# Altium schematic sheet JTAG ICE.SchDoc: JTAGICE
size A3; CheckedBy: Mohammad Sadr; Author: Mohammad Sadr; CompanyName: www.mElectronics.ir; DrawnBy: Mohammad Sadr; Engineer: Mohammad Sadr; Organization: Mohammad Sadr; Address1: Iran, Tehran; Address2: Shamsipour College (STVC); Address3: Electronic engineering; Address4: www.mElectronics.ir; DocumentNumber: 8.0; Revision: v 8.2; SheetNumber: 1; SheetTotal: 2; DocumentName: JTAGICE; ImagePath: Mohammad Sadr; ProjectName: JTAGICE
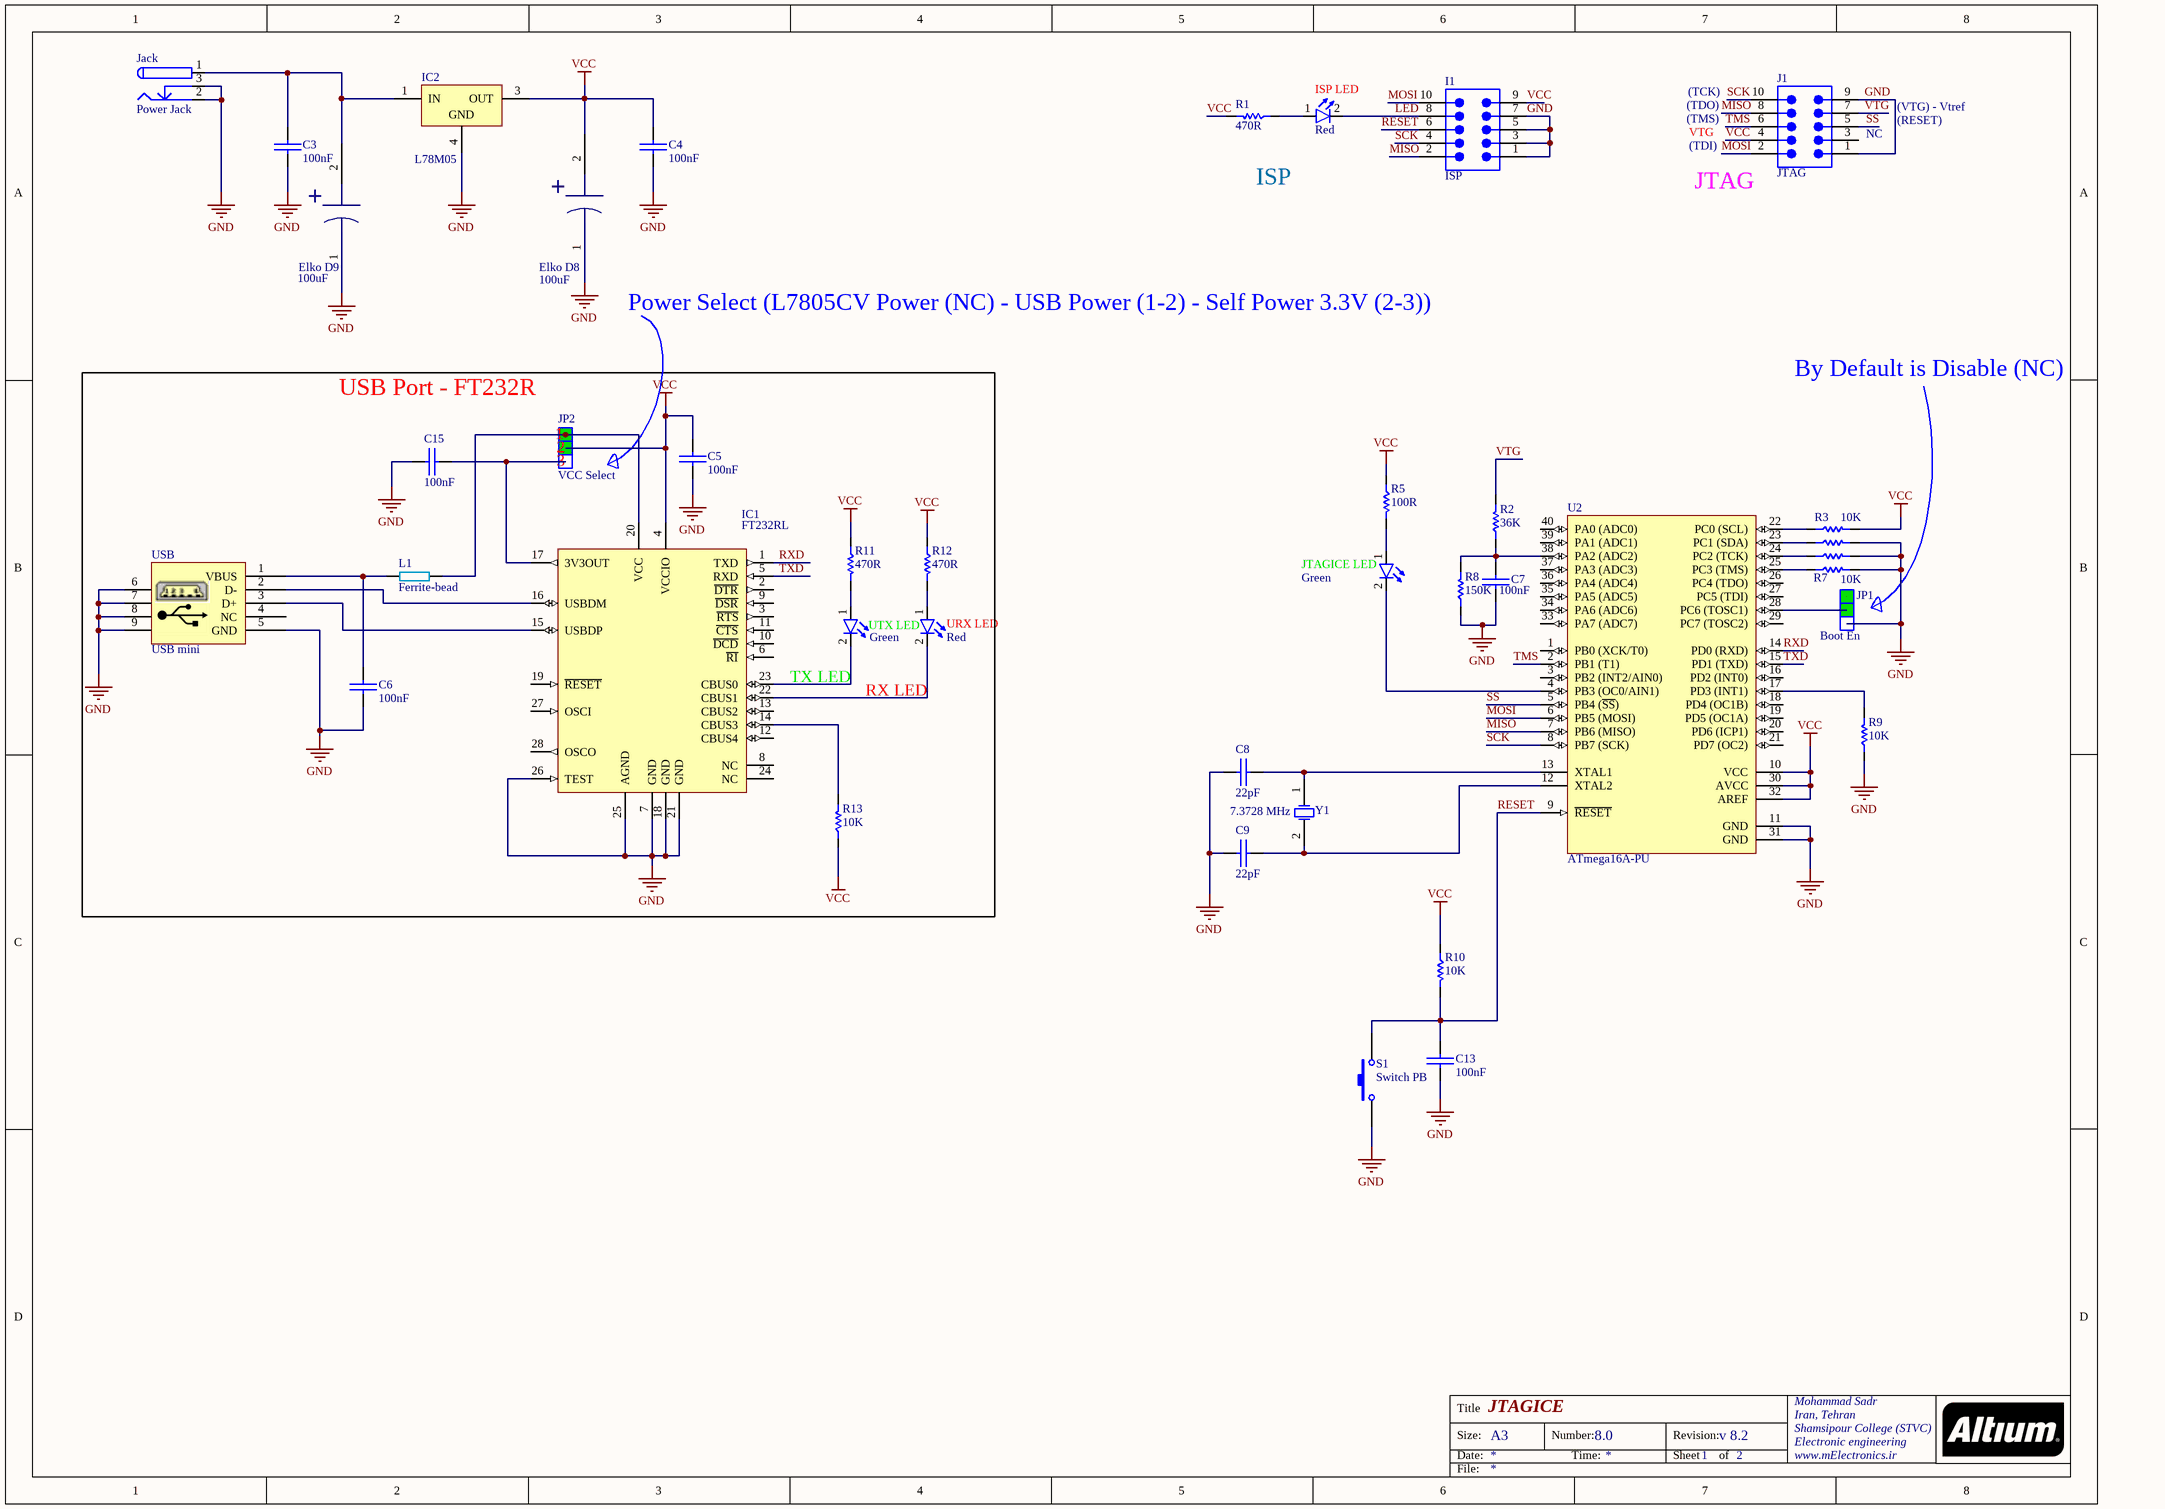
[diagram p0: JTAG ICE.SchDoc]

## Parts
C3  100nF  [SMD_CAP_1206]
C4  100nF  [SMD_CAP_1206]
C5  100nF  [SMD_CAP_1206]
C6  100nF  [SMD_CAP_1206]
C7  100nF  [SMD_CAP_1206]
C8  22pF  [SMD_CAP_1206]
C9  22pF  [SMD_CAP_1206]
C13  100nF  [SMD_CAP_1206]
C15  100nF  [SMD_CAP_1206]
Elko_D8  100uF  [Elko D8 package]
Elko_D9  100uF  [Elko D8 package]
I1  ISP  [9181109621]
IC1  FT232RL  [SSOP-28_M]
IC2  L78M05  [TO-263]
ISP_LED  Red  [LED SMD 1206]
J1  JTAG  [9181109621]
Jack  Power Jack  [Power Jack]
JP1  Boot En  [jumper selector]
JP2  VCC Select  [jumper selector]
JTAGICE_LED  Green  [LED SMD 1206]
L1  Ferrite-bead  [Ferrite-bead]
R1  470R  [SMD_RES_1206]
R2  36K  [SMD_RES_1206]
R3  10K  [SMD_RES_1206]
R4  10K  [SMD_RES_1206]  (value not drawn)
R5  100R  [SMD_RES_1206]
R6  10K  [SMD_RES_1206]  (value not drawn)
R7  10K  [SMD_RES_1206]
R8  150K  [SMD_RES_1206]
R9  10K  [SMD_RES_1206]
R10  10K  [SMD_RES_1206]
R11  470R  [SMD_RES_1206]
R12  470R  [SMD_RES_1206]
R13  10K  [SMD_RES_1206]
S1  Switch PB  [Switch - Push to On]
U2  ATmega16A-PU  [44A_M]
URX_LED  Red  [LED SMD 1206]
USB  USB mini  [SMD_Mini USB Connector]
UTX_LED  Green  [LED SMD 1206]
Y1  7.3728 MHz  [Crystal SMD]

## Blocks framed on the sheet
USB Port - FT232R: C5 C6 C15 IC1 JP2 L1 R11-R13 URX_LED USB UTX_LED

## Nets
GND: C3.2(-) C4.2(-) C5.2(-) C6.2(-) C7.2(-) C8.1(+) C9.1(+) C13.2(-) C15.1(+) Elko_D8.1 Elko_D9.1 I1.1 I1.3 I1.5 I1.7 IC1.7(GND) IC1.18(GND) IC1.21(GND) IC1.25(AGND) IC1.26(TEST) IC2.4(GND) J1.1 J1.9 Jack.2 Jack.3 JP1.3 R4.2 R6.2 R7.2 R8.1 R9.1 S1.1 U2.11(GND) U2.31(GND) USB.5(GND) USB.6 USB.7 USB.8 USB.9
VCC: C4.1(+) C5.1(+) Elko_D8.2 I1.9 IC1.4(VCCIO) IC2.3(OUT) J1.4 JP2.2 R1.2 R3.2 R5.1 R10.1 R11.1 R12.1 R13.1 U2.10(VCC) U2.30(AVCC) U2.32(AREF)
LED: I1.8 ISP_LED.2(K)
MISO: I1.2 J1.8 U2.7(PB6_(MISO))
MOSI: I1.10 J1.2 U2.6(PB5_(MOSI))
RESET: C13.1(+) I1.6 R10.2 S1.2 U2.9(~{RESET})
RXD: IC1.1(TXD) U2.14(PD0_(RXD))
SCK: I1.4 J1.10 U2.8(PB7_(SCK))
SS: J1.5 U2.5(PB4_(~{SS}))
TMS: J1.6 U2.2(PB1_(T1))
TXD: IC1.5(RXD) U2.15(PD1_(TXD))
VTG: J1.7 R2.2
NetC3_1: C3.1(+) Elko_D9.2 IC2.1(IN) Jack.1
NetC6_1: C6.1(+) L1.1 USB.1(VBUS)
NetC7_1: C7.1(+) R2.1 R8.2 U2.38(PA2_(ADC2))
NetC8_2: C8.2(-) U2.13(XTAL1) Y1.1(OSC1)
NetC9_2: C9.2(-) U2.12(XTAL2) Y1.2(OSC2)
NetC15_2: C15.2(-) IC1.17(3V3OUT) JP2.3
NetIC1_14: IC1.14(CBUS3) R13.2
NetIC1_15: IC1.15(USBDP) USB.3(D+)
NetIC1_16: IC1.16(USBDM) USB.2(D-)
NetIC1_20: IC1.20(VCC) JP2.1 L1.2
NetIC1_22: IC1.22(CBUS1) URX_LED.2(K)
NetIC1_23: IC1.23(CBUS0) UTX_LED.2(K)
NetISP_LED_1: ISP_LED.1(A) R1.1
NetJP1_2: JP1.2 U2.28(PC6_(TOSC1))
NetJTAGICE_LED_1: JTAGICE_LED.1(A) R5.2
NetJTAGICE_LED_2: JTAGICE_LED.2(K) U2.4(PB3_(OC0/AIN1))
NetR3_1: R3.1 U2.22(PC0_(SCL))
NetR4_1: R4.1 U2.23(PC1_(SDA))
NetR6_1: R6.1 U2.24(PC2_(TCK))
NetR7_1: R7.1 U2.25(PC3_(TMS))
NetR9_2: R9.2 U2.17(PD3_(INT1))
NetR11_2: R11.2 UTX_LED.1(A)
NetR12_2: R12.2 URX_LED.1(A)

Not connected (* = marked no-connect by the designer): IC1 2(~{DTR}) 3(~{RTS}) 6(~{RI}) 8(NC) 9(~{DSR}) 10(~{DCD}) 11(~{CTS}) 12(CBUS4) 13(CBUS2) 19(~{RESET}) 24(NC) 27(OSCI) 28(OSCO); J1 3; JP1 1; U2 1(PB0_(XCK/T0)) 3(PB2_(INT2/AIN0)) 16(PD2_(INT0)) 18(PD4_(OC1B)) 19(PD5_(OC1A)) 20(PD6_(ICP1)) 21(PD7_(OC2)) 26(PC4_(TDO)) 27(PC5_(TDI)) 29(PC7_(TOSC2)) 33(PA7_(ADC7)) 34(PA6_(ADC6)) 35(PA5_(ADC5)) 36(PA4_(ADC4)) 37(PA3_(ADC3)) 39(PA1_(ADC1)) 40(PA0_(ADC0)); USB 4(NC)

## Notes on the sheet
- (TDO)
- (TCK)
- (VTG) - Vtref
- (TMS)
- VTG
- (TDI)
- (near J1) NC
- (RESET)
- ISP
- (near J1) JTAG
- (near Elko_D8) Power Select (L7805CV Power (NC) - USB Power (1-2) - Self Power 3.3V (2-3))
- By Default is Disable (NC)
- (near JP2) 1
- (near JP2) 2
- (near JP2) 3
- TX LED
- RX LED
- Title
- Size:
- Date:
- A3
- Number:
- Time:
- Revision:
- Sheet
- of
- File:
- (in symbol Elko D8 package) +

## Library data of the parts
C3-C9 C13 C15 = Cap-Bipolar: Bipolar Capacitor; Voltage: 100V; Designer: Saeid Jorablo; Organazation: ControTec; Adding Date: 1387/12/20
  C3-C7 C13 C15: Value: 100nF
  C8 C9: Value: 22pF
Elko_D8 Elko_D9 = Elko D8 package: Elko D8 package: 100uF
I1 J1 = 09 18 110 9621: Flat Cable Connector (IDC), PCB Transition Connector, 2 Rows, Solder Pin, 10 Contacts; PCB_Layout: Complies with manufacturer's recommendation.; DrillSize: Corresponds to nominal value.; Published: 15-Nov-2004; DatasheetDocument: Sep-2003; PackageDocument: 26-Nov-2003; PackageReference: 9181109621; Publisher: Altium Limited; ComponentLink1Description: Manufacturer Link; ComponentLink1URL: http://www.harting.com/; ComponentLink2Description: Selection Guide; ComponentLink2URL: http://www.harting.com/imperia/md/content/steckverbinderundsystemkomponenten/folder/interface_engl_chapter_09.pdf
IC1 = FT232RL: USB UART Asynchronous Serial Data Transfer Chip, SSOP-28, Tape and Reel; Published: 19-Aug-2010; DatasheetVersion: ver 2.07, Jul-2010; PackageVersion: 2010; PackageReference: SSOP-28; Publisher: Altium Limited; PackageDescription: 28-Pin Small Outline Package 0.65 mm Pitch; ComponentLink1Description: Manufacturer Link; ComponentLink1URL: http://www.ftdichip.com/Products/ICs/FT232R.htm; ComponentLink2Description: Datasheet; ComponentLink2URL: http://www.ftdichip.com/Support/Documents/DataSheets/ICs/DS_FT232R.pdf
IC2 = L78M05: Precision 500mA Regulator
ISP_LED JTAGICE_LED URX_LED UTX_LED = LED: Designer: Saeid Jorablo; Organazation: ControTec; Adding Date: 1387/12/22; Size: SMD 1206
  ISP_LED URX_LED: Color: Red
  JTAGICE_LED UTX_LED: Color: Green
Jack = Power Jack: Designer: Saeid Jorablo; Company: Personal; Project Name: Laser; Adding Date: 10/21/2009
JP1 JP2 = Jumper Selector
R1-R13 = Resistor: Tolerance: 5%; Power: 1/4 W
  R1 R11 R12: Value: 470R
  R2: Value: 36K
  R3 R4 R6 R7 R9 R10 R13: Value: 10K
  R5: Value: 100R
  R8: Value: 150K
S1 = Switch PB: Push Button Switch
U2 = ATmega16A-PU: 8-bit AVR Microcontroller, 16KB Flash, 512 Bytes EEPROM, 1KB SRAM, 40-pin PDIP, Industrial Grade (-40°C to 85°C); Published: 1-Apr-2010; DatasheetVersion: revB, Jul-2009; PackageVersion: revB, Sep-2001; PackageReference: 40P6; Publisher: Altium Limited; PackageDescription: 40-lead (0.600"/15.24mm Wide) Plastic Dual Inline Package (PDIP); Supplier 1: Digi-Key; Supplier Part Number 1: ATMEGA16A-PU-ND; Supplier 2: Farnell; Supplier Part Number 2: 1704561; Supplier 3: Mouser; Supplier Part Number 3: 556-ATMEGA16A-PU; Code_JEDEC: MS-011-AC; ComponentLink1Description: Manufacturer Link; ComponentLink1URL: http://www.atmel.com/products/avr/default.asp?; ComponentLink2Description: ATmega16A Datasheet; ComponentLink2URL: http://www.atmel.com/dyn/resources/prod_documents/doc8154.pdf; ComponentLink3Description: ATmega16A Summary; ComponentLink3URL: http://www.atmel.com/dyn/resources/prod_documents/8154S.pdf; ComponentLink4Description: Atmel.com Home; ComponentLink4URL: http://www.atmel.com
USB = USB mini: mini USB Connector
Y1 = XTAL: XTAL Crystal; Company: E.P.I.L; Design Date: 11/04/2011; Value: 7.3728 MHz